# Altium project Odrive_M.PrjPcb (part 1 of 2)
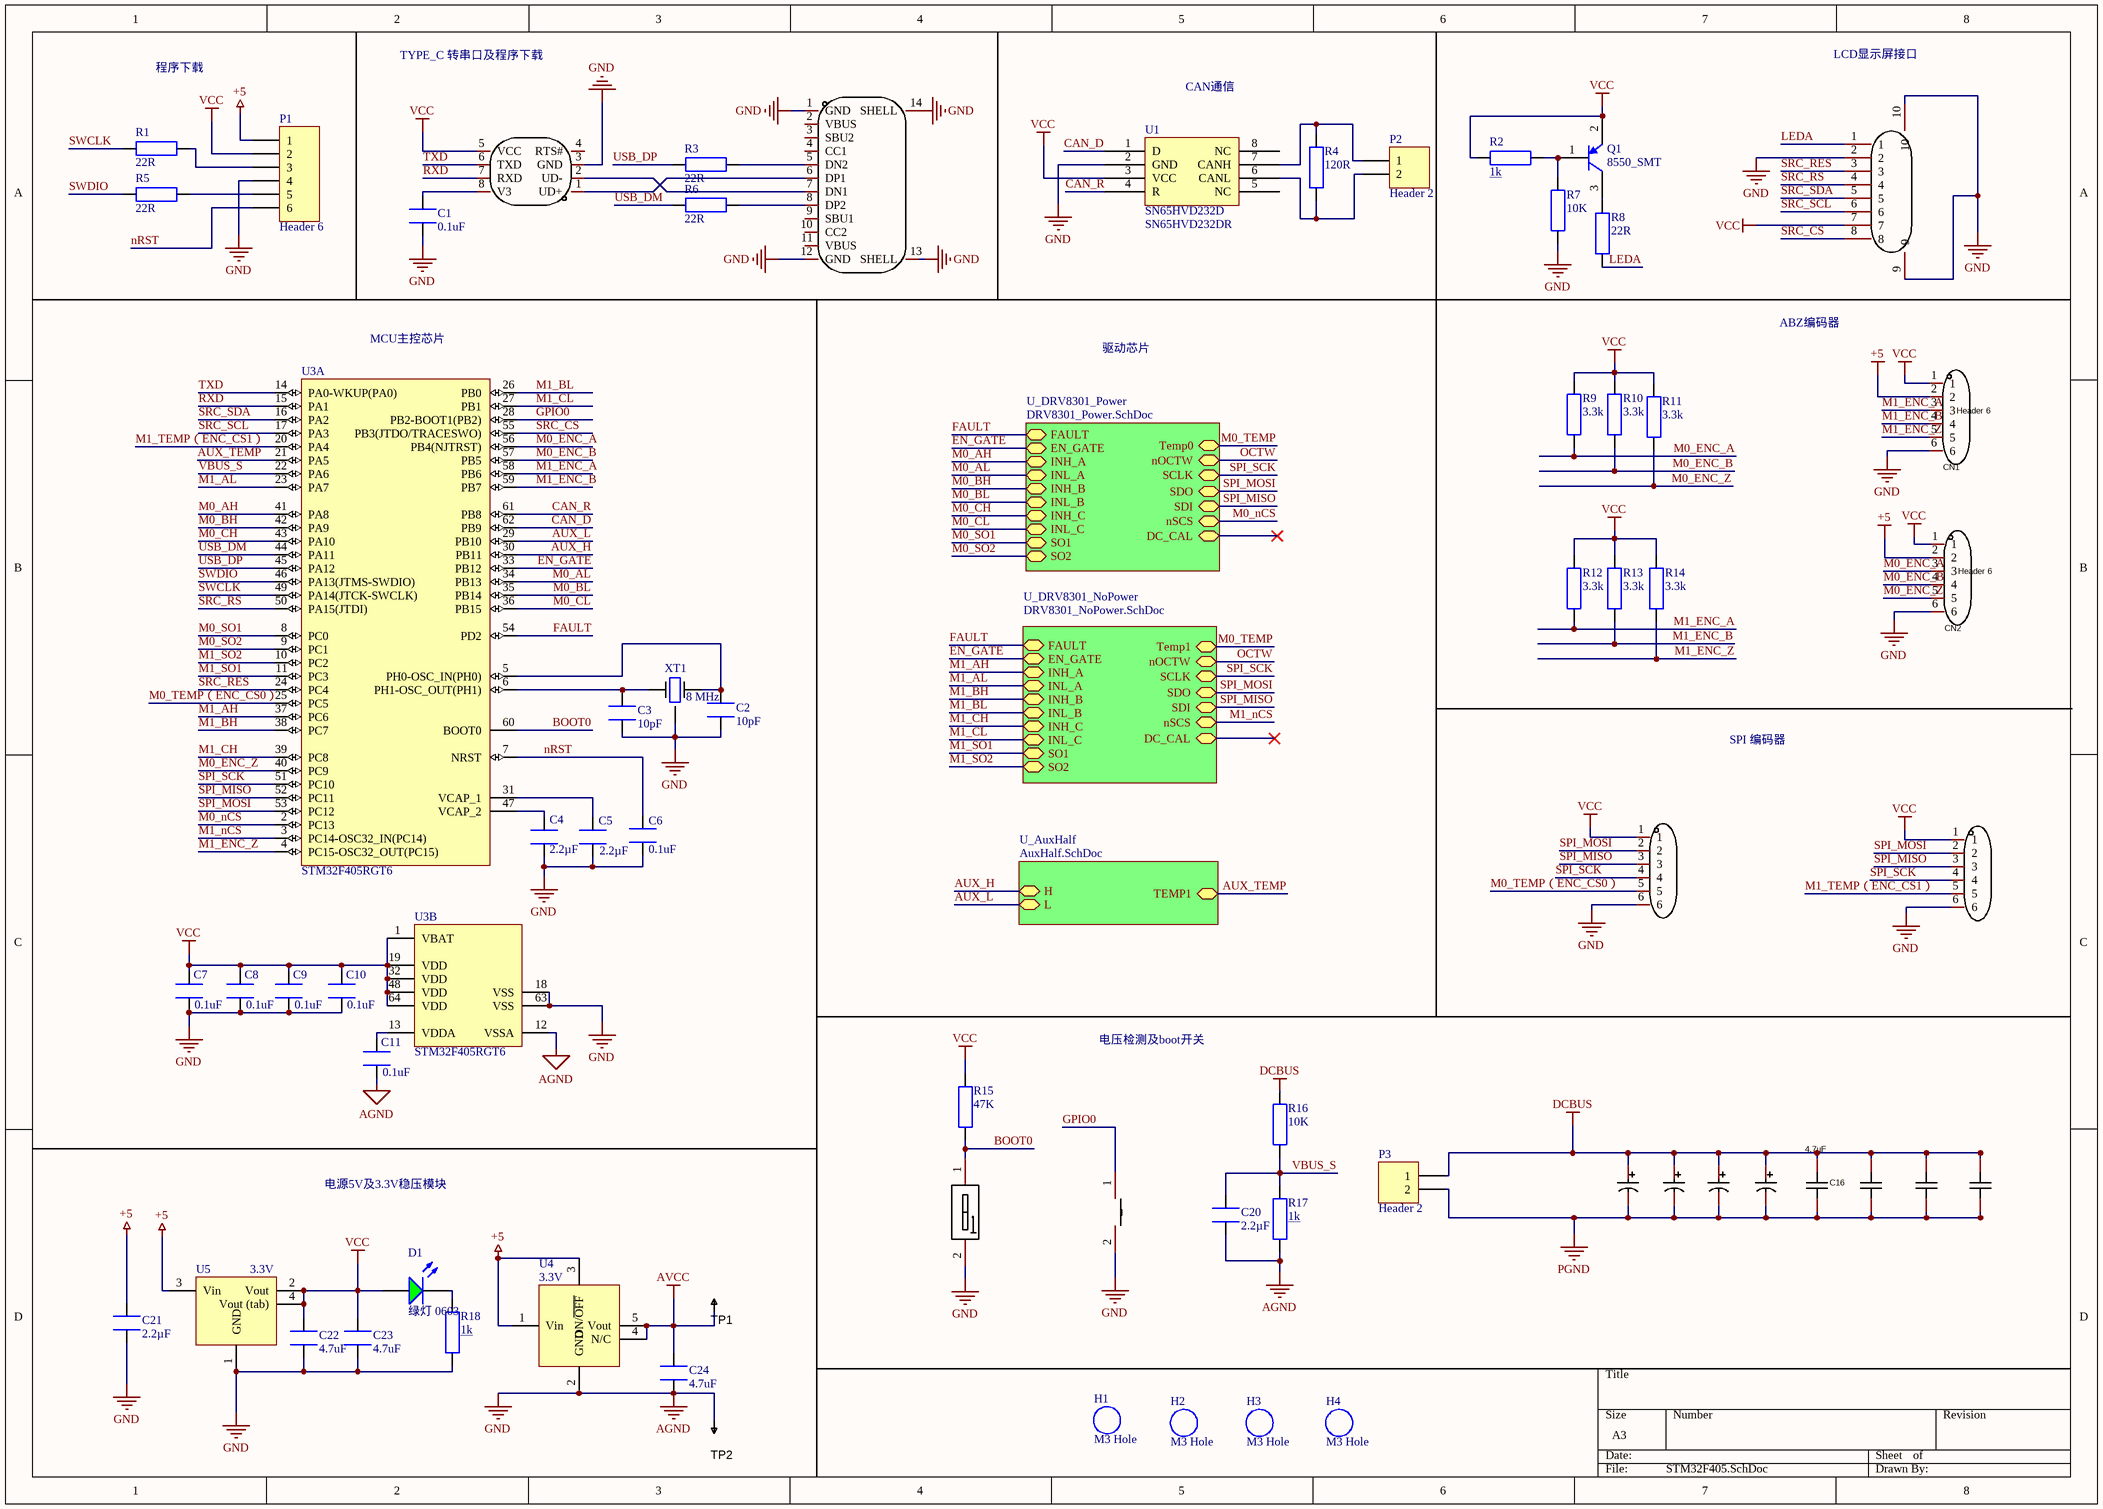
[diagram p0: STM32F405.SchDoc]
4 sheets, 190 parts. Net scope: hierarchical (ports join the sheet entries above them; power ports are global).
Board files: back_STM32F405.PcbDoc, back4_STM32F405.PcbDoc, STM32F405.PcbDoc
Sheets:
  STM32F405.SchDoc
    U_AuxHalf = AuxHalf.SchDoc
    U_DRV8301_Power = DRV8301_Power.SchDoc
    U_DRV8301_NoPower = DRV8301_NoPower.SchDoc

## Sheet STM32F405.SchDoc
size A3; SheetNumber: 1; SheetTotal: 4

### Parts
C1  0.1uF  [CAPC1608X09L]
C2  10pF  [CAPC1608X09L]
C3  10pF  [CAPC1608X09L]
C4  2.2µF  [CAPC1608X09L]
C5  2.2µF  [CAPC1608X09L]
C6  0.1uF  [CAPC1608X09L]
C7  0.1uF  [CAPC1608X09L]
C8  0.1uF  [CAPC1608X09L]
C9  0.1uF  [CAPC1608X09L]
C10  0.1uF  [CAPC1608X09L]
C11  0.1uF  [CAPC1608X09L]
C12  220uF  [CAP-SMD_BD12.5-L13.0-W13.0-FD]  (value not drawn)
C13  220uF  [CAP-SMD_BD12.5-L13.0-W13.0-FD]  (value not drawn)
C14  220uF  [CAP-SMD_BD12.5-L13.0-W13.0-FD]  (value not drawn)
C15  220uF  [CAP-SMD_BD12.5-L13.0-W13.0-FD]  (value not drawn)
C16  4.7uF  [C1210]
C17  4.7uF  [C1210]  (value not drawn)
C18  4.7uF  [C1210]  (value not drawn)
C19  4.7uF  [C1210]  (value not drawn)
C20  2.2µF  [CAPC1608X09L]
C21  2.2µF  [CAPC1608X09L]
C22  value 4.7uF  [CAPC2012X09N]  (hidden comment: GRM21BR61H475KE51L)
C23  value 4.7uF  [CAPC2012X09N]  (hidden comment: GRM21BR61H475KE51L)
C24  value 4.7uF  [CAPC2012X09N]  (hidden comment: GRM21BR61H475KE51L)
CN1  Header 6  [XH254-6]
CN2  Header 6  [XH254-6]
CN3  X8821WR-06S-N0SN  [CONN-TH_6P-P2.50_X8821WR-06S-N2SN]  (value not drawn)
CN4  X8821WR-06S-N0SN  [CONN-TH_6P-P2.50_X8821WR-06S-N2SN]  (value not drawn)
D1  绿灯 0603  [0603_LED_S1]
FPC1  AFC01-S08FCA-00  [FPC-SMD_P0.50-8P_FGS-XJ-H2.0]  (value not drawn)
H1  M3 Hole  [M3 Hole]
H2  M3 Hole  [M3 Hole]
H3  M3 Hole  [M3 Hole]
H4  M3 Hole  [M3 Hole]
P1  Header 6  [SIP-6]
P2  Header 2  [XH254-2]
P3  Header 2  [CONN-TH_XT30U-M]
Q1  8550_SMT  [SOT-23(SOT-23-3)]
R1  22R  [RESC1608X55N]
R2  1k  [RESC1608X55N]
R3  22R  [RESC1608X55N]
R4  120R  [RESC1608X55N]
R5  22R  [RESC1608X55N]
R6  22R  [RESC1608X55N]
R7  10K  [RESC1608X55N]
R8  22R  [RESC1608X55N]
R9  3.3k  [RESC1608X55N]
R10  3.3k  [RESC1608X55N]
R11  3.3k  [RESC1608X55N]
R12  3.3k  [RESC1608X55N]
R13  3.3k  [RESC1608X55N]
R14  3.3k  [RESC1608X55N]
R15  47K  [RESC1608X55N]
R16  10K  [RESC1608X55N]
R17  1k  [RESC1608X55N]
R18  1k  [RESC1608X55N]
SW1  DSWB01LHGET  [SW-TH_DSWB01LHGET]  (value not drawn)
SW2  TS-1101-C-W  [SW-SMD_L6.0-W3.3-LS8.0]  (value not drawn)
TP1  TESTPOINT  [TP-R30]  (value not drawn)  (no BOM)
TP2  TESTPOINT  [TP-R30]  (value not drawn)  (no BOM)
U1  SN65HVD232D  Manufacturer Part Number: SN65HVD232DR  [SOIC127P600X175-8N]
U2  CH340N  [ch340N  SOP-8_L4.9-W3.9-P1.27-LS6.0-BL]  (value not drawn)
U3  STM32F405RGT6  [STM-LQFP64_N]  (parts A,B of 2)
U4  3.3V  [SOT23-5]
U5  3.3V  [SOT223]
USB1  TYPE-C 16PIN 2MD(073)  [USB-C-SMD_TYPE-C-16PIN-2MD-073]  (value not drawn)
XT1  8 MHz  [DFN220P320X110-4N]

### Sub-sheets
U_AuxHalf = AuxHalf.SchDoc: TEMP1 (bidir), H (bidir), L (bidir)
U_DRV8301_NoPower = DRV8301_NoPower.SchDoc: Temp1 (bidir), FAULT (bidir), EN_GATE (bidir), INH_A (bidir), INL_A (bidir), INH_B (bidir), INL_B (bidir), INH_C (bidir), INL_C (bidir), SO1 (bidir), SO2 (bidir), nOCTW (bidir), SCLK (bidir), SDO (bidir), SDI (bidir), nSCS (bidir), DC_CAL (bidir)
U_DRV8301_Power = DRV8301_Power.SchDoc: FAULT (bidir), EN_GATE (bidir), INH_A (bidir), INL_A (bidir), INH_B (bidir), INL_B (bidir), INH_C (bidir), INL_C (bidir), SO1 (bidir), SO2 (bidir), Temp0 (bidir), nOCTW (bidir), SCLK (bidir), SDO (bidir), SDI (bidir), nSCS (bidir), DC_CAL (bidir)

### Nets
+5: C21.2 CN1.2 CN2.2 P1.1 U4.1(Vin) U4.3(ON/~{OFF}) U5.3(Vin)
AGND: C1.1 C2.2 C3.2 C4.1 C5.1 C6.1 C7.1 C8.1 C9.1 C10.1 C11.1 C20.1 C21.1 C22.1 C23.1 C24.1 CN1.6 CN2.6 CN3.6 CN4.6 FPC1.2 FPC1.9 FPC1.10 P1.4 R7.1 R17.1 R18.1 SW1.2 SW2.2 TP2.1 U1.2(GND) U2.3(GND) U3.12(VSSA) U3.18(VSS) U3.63(VSS) U4.2(GND) U5.1(GND) USB1.1(GND) USB1.12(GND) USB1.13(SHELL) USB1.14(SHELL) XT1.G  [also labelled GND]
AVCC: C24.2 TP1.1 U4.4(N/C) U4.5(Vout)
DCBUS: C12.1 C13.1 C14.1 C15.1 C16.1 C17.2 C18.2 C19.2 P3.1 R16.2
PGND: C12.2 C13.2 C14.2 C15.2 C16.2 C17.1 C18.1 C19.1 P3.2
VCC: C7.2 C8.2 C9.2 C10.2 C22.2 C23.2 CN1.1 CN2.1 CN3.1 CN4.1 D1.A FPC1.7 P1.2 Q1.2(E) R2.2 R9.2 R10.2 R11.2 R12.2 R13.2 R14.2 R15.2 U1.3(VCC) U2.5(VCC) U3.1(VBAT) U3.19(VDD) U3.32(VDD) U3.48(VDD) U3.64(VDD) U5.2(Vout) U5.4(Vout_(tab))
AUX_H: U3.30(PB11) ; sheet U_AuxHalf/H
AUX_L: U3.29(PB10) ; sheet U_AuxHalf/L
AUX_TEMP: U3.21(PA5) ; sheet U_AuxHalf/TEMP1
BOOT0: R15.1 SW1.1(A1) U3.60(BOOT0)  [project net BOOT0_1]
CAN_D: U1.1(D) U3.62(PB9)  [project net CAN_D_1]
CAN_R: U1.4(R) U3.61(PB8)  [project net CAN_R_1]
EN_GATE: U3.33(PB12) ; sheet U_DRV8301_Power/EN_GATE, sheet U_DRV8301_NoPower/EN_GATE
FAULT: U3.54(PD2) ; sheet U_DRV8301_Power/FAULT, sheet U_DRV8301_NoPower/FAULT
GPIO0: SW2.1 U3.28(PB2-BOOT1(PB2))  [project net GPIO0_1]
LEDA: FPC1.1 R8.1  [project net LEDA_1]
M0_AH: U3.41(PA8) ; sheet U_DRV8301_Power/INH_A
M0_AL: U3.34(PB13) ; sheet U_DRV8301_Power/INL_A
M0_BH: U3.42(PA9) ; sheet U_DRV8301_Power/INH_B
M0_BL: U3.35(PB14) ; sheet U_DRV8301_Power/INL_B
M0_CH: U3.43(PA10) ; sheet U_DRV8301_Power/INH_C
M0_CL: U3.36(PB15) ; sheet U_DRV8301_Power/INL_C
M0_ENC_A: CN2.3 R9.1 U3.56(PB4(NJTRST))  [project net M0_ENC_A_1]
M0_ENC_B: CN2.4 R10.1 U3.57(PB5)  [project net M0_ENC_B_1]
M0_ENC_Z: CN2.5 R11.1 U3.40(PC9)  [project net M0_ENC_Z_1]
M0_nCS: U3.2(PC13) ; sheet U_DRV8301_Power/nSCS
M0_SO1: U3.8(PC0) ; sheet U_DRV8301_Power/SO1
M0_SO2: U3.9(PC1) ; sheet U_DRV8301_Power/SO2
M0_TEMP: sheet U_DRV8301_Power/Temp0, sheet U_DRV8301_NoPower/Temp1
M0_TEMP（ENC_CS0）: CN3.5 U3.25(PC5)  [project net M0_TEMP（ENC_CS0）_1]
M1_AH: U3.37(PC6) ; sheet U_DRV8301_NoPower/INH_A
M1_AL: U3.23(PA7) ; sheet U_DRV8301_NoPower/INL_A
M1_BH: U3.38(PC7) ; sheet U_DRV8301_NoPower/INH_B
M1_BL: U3.26(PB0) ; sheet U_DRV8301_NoPower/INL_B
M1_CH: U3.39(PC8) ; sheet U_DRV8301_NoPower/INH_C
M1_CL: U3.27(PB1) ; sheet U_DRV8301_NoPower/INL_C
M1_ENC_A: CN1.3 R12.1 U3.58(PB6)  [project net M1_ENC_A_1]
M1_ENC_B: CN1.4 R13.1 U3.59(PB7)  [project net M1_ENC_B_1]
M1_ENC_Z: CN1.5 R14.1 U3.4(PC15-OSC32_OUT(PC15))  [project net M1_ENC_Z_1]
M1_nCS: U3.3(PC14-OSC32_IN(PC14)) ; sheet U_DRV8301_NoPower/nSCS
M1_SO1: U3.11(PC3) ; sheet U_DRV8301_NoPower/SO1
M1_SO2: U3.10(PC2) ; sheet U_DRV8301_NoPower/SO2
M1_TEMP（ENC_CS1）: CN4.5 U3.20(PA4)  [project net M1_TEMP（ENC_CS1）_1]
nRST: C6.2 P1.6 U3.7(NRST)  [project net nRST_1]
OCTW: sheet U_DRV8301_Power/nOCTW, sheet U_DRV8301_NoPower/nOCTW
RXD: U2.7(RXD) U3.15(PA1)  [project net RXD_1]
SPI_MISO: CN3.3 CN4.3 U3.52(PC11) ; sheet U_DRV8301_Power/SDI, sheet U_DRV8301_NoPower/SDI
SPI_MOSI: CN3.2 CN4.2 U3.53(PC12) ; sheet U_DRV8301_Power/SDO, sheet U_DRV8301_NoPower/SDO
SPI_SCK: CN3.4 CN4.4 U3.51(PC10) ; sheet U_DRV8301_Power/SCLK, sheet U_DRV8301_NoPower/SCLK
SRC_CS: FPC1.8 U3.55(PB3(JTDO/TRACESWO))  [project net SRC_CS_1]
SRC_RES: FPC1.3 U3.24(PC4)  [project net SRC_RES_1]
SRC_RS: FPC1.4 U3.50(PA15(JTDI))  [project net SRC_RS_1]
SRC_SCL: FPC1.6 U3.17(PA3)  [project net SRC_SCL_1]
SRC_SDA: FPC1.5 U3.16(PA2)  [project net SRC_SDA_1]
SWCLK: R1.2 U3.49(PA14(JTCK-SWCLK))  [project net SWCLK_1]
SWDIO: R5.2 U3.46(PA13(JTMS-SWDIO))  [project net SWDIO_1]
TXD: U2.6(TXD) U3.14(PA0-WKUP(PA0))  [project net TXD_1]
USB_DM: R6.2 U3.44(PA11)  [project net USB_DM_1]
USB_DP: R3.2 U3.45(PA12)  [project net USB_DP_1]
VBUS_S: C20.2 R16.1 R17.2 U3.22(PA6)  [project net VBUS_S_1]
NetC1_2: C1.2 U2.8(V3)
NetC2_1: C2.1 U3.5(PH0-OSC_IN(PH0)) XT1.3
NetC3_1: C3.1 U3.6(PH1-OSC_OUT(PH1)) XT1.1
NetC4_2: C4.2 U3.47(VCAP_2)
NetC5_2: C5.2 U3.31(VCAP_1)
NetC11_2: C11.2 U3.13(VDDA)
NetD1_K: D1.K R18.2
NetP1_3: P1.3 R1.1
NetP1_5: P1.5 R5.1
NetP2_1: P2.1 R4.2 U1.7(CANH)
NetP2_2: P2.2 R4.1 U1.6(CANL)
NetQ1_1: Q1.1(B) R2.1 R7.2
NetQ1_3: Q1.3(C) R8.2
NetR3_1: R3.1 USB1.5(DN2)
NetR6_1: R6.1 USB1.8(DP2)
NetU2_1: U2.1(UD+) USB1.6(DP1)
NetU2_2: U2.2(UD-) USB1.7(DN1)

Not connected (* = marked no-connect by the designer): U1 5(NC) 8(NC); U2 4(RTS#); USB1 2(VBUS) 3(SBU2) 4(CC1) 9(SBU1) 10(CC2) 11(VBUS)

### Notes on the sheet
- 程序下载
- TYPE_C 转串口及程序下载
- CAN通信
- LCD显示屏接口
- (near U3) MCU主控芯片
- 驱动芯片
- ABZ编码器
- SPI 编码器
- 电压检测及boot开关
- 电源5V及3.3V稳压模块

### Library data of the parts
C1 C6-C11 = GRM188R71H104KA93D: CAP CER 0.1UF 50V X7R 0603; Manufacturer: Murata Electronics North America; Tolerance: ±10%; Supplier 1: Digi-Key; Supplier Part Number 1: 490-1519-2-ND; Manufacturer Part Number: GRM188R71H104KA93D; RoHS: RoHS Compliant; Category: Capacitors; Pricing 1: 4000=0.01822, 8000=0.01663, 12000=0.01584 (USD); Packaging: Tape & Reel (TR); Capacitance: 0.1uF; Voltage - Rated: 50V; Temperature Coefficient: X7R; Mounting Type: Surface Mount, MLCC; Operating Temperature: -55°C ~ 125°C; Applications: General Purpose; Ratings: -; Package / Case: 0603 (1608 Metric); Size / Dimension: 0.063" L x 0.032" W (1.60mm x 0.80mm); Height - Seated (Max): -; Thickness (Max): 0.035" (0.90mm); Lead Spacing: -; Features: -; Lead Style: -; ComponentLink1URL: http://www.murata.com/~/media/webrenewal/support/library/catalog/products/capacitor/mlcc/c02e.ashx?la=en-us; ComponentLink1Description: http://www.murata.com/~/media/webrenewal/support/library/catalog/products/capacitor/mlcc/c02e.ashx?la=en-us; Stock: 19812000; Part Status: Active; Supplier 2: Digi-Key; Supplier Part Number 2: 490-1519-1-ND; Pricing 2: 1=0.12, 10=0.084, 100=0.0396, 500=0.02778, 1000=0.023 (USD)
C2 C3 = GRM1885C1H100JA01D: CAP CER 10PF 50V NP0 0603; Manufacturer: Murata Electronics North America; Tolerance: ±5%; Temperature Coefficient: C0G, NP0; Supplier 1: Digi-Key; Supplier Part Number 1: 490-1403-1-ND; Manufacturer Part Number: GRM1885C1H100JA01D; RoHS: RoHS Compliant; Category: Capacitors; Stock 1: 450321; Pricing 1: 1=0.1, 10=0.041, 50=0.0222, 100=0.0187, 250=0.01532, 500=0.0131, 1000=0.0102 (USD); Packaging: Cut Tape (CT); Capacitance: 10pF; Voltage - Rated: 50V; Mounting Type: Surface Mount, MLCC; Operating Temperature: -55°C ~ 125°C; Applications: General Purpose; Ratings: -; Package / Case: 0603 (1608 Metric); Size / Dimension: 0.063" L x 0.031" W (1.60mm x 0.80mm); Height - Seated (Max): -; Thickness (Max): 0.035" (0.90mm); Lead Spacing: -; Features: -; Lead Style: -; ComponentLink1URL: http://www.murata.com/~/media/webrenewal/support/library/catalog/products/capacitor/mlcc/c02e.pdf; ComponentLink1Description: http://www.murata.com/~/media/webrenewal/support/library/catalog/products/capacitor/mlcc/c02e.pdf
C4 C5 C20 C21 = GRM188R61C225KE15D: CAP CER 2.2UF 16V X5R 0603; Manufacturer: Murata Electronics North America; Tolerance: ±10%; Supplier 1: Digi-Key; Supplier Part Number 1: 490-3296-1-ND; Manufacturer Part Number: GRM188R61C225KE15D; RoHS: RoHS Compliant; Category: Capacitors; Stock 1: 1255740; Pricing 1: 1=0.12, 10=0.08, 50=0.046, 100=0.038, 250=0.032, 500=0.0268, 1000=0.022 (USD); Packaging: Cut Tape (CT); Capacitance: 2.2µF; Voltage - Rated: 16V; Temperature Coefficient: X5R; Mounting Type: Surface Mount, MLCC; Operating Temperature: -55°C ~ 85°C; Applications: General Purpose; Ratings: -; Package / Case: 0603 (1608 Metric); Size / Dimension: 0.063" L x 0.031" W (1.60mm x 0.80mm); Height - Seated (Max): -; Thickness (Max): 0.035" (0.90mm); Lead Spacing: -; Features: -; Lead Style: -; ComponentLink1URL: http://www.murata.com/~/media/webrenewal/support/library/catalog/products/capacitor/mlcc/c02e.pdf; ComponentLink1Description: http://www.murata.com/~/media/webrenewal/support/library/catalog/products/capacitor/mlcc/c02e.pdf
C12-C15 = VZH221M1JTR-1313: 63v 220uF 贴片电容; Manufacturer: lelon(立隆); Symbol: VZH221M1J1313-TRO; Add into BOM: yes; Tolerance: ±20%; φD: 12.5mm; L: 13.5mm; Lifetime @ Temp: 5000hrs@105℃; Name: 220uF; Device: VZH221M1JTR-1313; LCSC Part Name: 220uF ±20% 63V; Supplier Part: C249882; Manufacturer Part: VZH221M1JTR-1313; Supplier Footprint: SMD,D12.5xL13.5mm; JLCPCB Part Class: Extended Part; Datasheet: https://atta.szlcsc.com/upload/public/pdf/source/20190107/C358632_9559F0E8F2A4CAD9C84FAF7E6C56D904.pdf; Supplier: LCSC; Convert to PCB: yes; Value: 220uF; Rated Voltage: 63V; Ripple Current: -; Equivalent Series Resistance(ESR): -; Operating Temperature: -45℃~+105℃
C16-C19 = C1210X7R475K630NT: 4.7uF 63V 1210封装; Manufacturer: SANYEAR(叁叶源); Add into BOM: yes; Temperature Coefficient: X7R; Name: 4.7uF; Symbol: C1210X7R475K630NT; Device: C1210X7R475K630NT; LCSC Part Name: 4.7uF 63V; Supplier Part: C2911397; Manufacturer Part: C1210X7R475K630NT; Supplier Footprint: 1210; JLCPCB Part Class: Extended Part; Datasheet: https://atta.szlcsc.com/upload/public/pdf/source/20210902/8F39E0658D363F48630A7672568BDC14.pdf; Supplier: LCSC; Convert to PCB: yes; Value: 4.7uF; Voltage Rated: 63V
C22-C24 = GRM21BR61H475KE51L: CAP CER 4.7UF 50V X5R 0805; Manufacturer: Murata Electronics North America; Tolerance: ±10%; Supplier 1: Digi-Key; Supplier Part Number 1: 490-10751-2-ND; RoHS: RoHS Compliant; Category: Capacitors; Stock: 15000; Pricing 1: 3000=0.08404, 6000=0.07774, 9000=0.07354 (USD); Packaging: Tape & Reel (TR); Part Status: Active; Voltage - Rated: 50V; Temperature Coefficient: X5R; Operating Temperature: -55°C ~ 85°C; Features: -; Ratings: -; Applications: General Purpose; Mounting Type: Surface Mount, MLCC; Package / Case: 0805 (2012 Metric); Size / Dimension: 0.079" L x 0.049" W (2.00mm x 1.25mm); Height - Seated (Max): -; Thickness (Max): 0.055" (1.40mm); Lead Spacing: -; Lead Style: -; ComponentLink1URL: http://search.murata.co.jp/Ceramy/image/img/A01X/G101/ENG/GRM21BR61H475KE51-01.pdf; ComponentLink1Description: http://search.murata.co.jp/Ceramy/image/img/A01X/G101/ENG/GRM21BR61H475KE51-01.pdf; Supplier 2: Digi-Key; Supplier Part Number 2: 490-10751-1-ND; Pricing 2: 1=0.35, 10=0.242, 100=0.145, 500=0.10872, 1000=0.09181 (USD); Manufacturer Part Number: GRM21BR61H475KE51L
CN1-CN4 = X8821WR-06S-N0SN: 6p 90度弯插; Manufacturer: XKB Connection(中国星坤); Add into BOM: yes; Pins Structure: 1x6P; Pitch: 2.5mm; Reference Series: XH; Number of PINs Per Row: 6; Current Rating (Max): 3A; Name: X8821WR-06S-N0SN; Symbol: X8821WR-06S-N0SN; Device: X8821WR-06S-N0SN; LCSC Part Name: 1x6P 间距:2.5mm 弯插 系列:XH; Supplier Part: C388743; Manufacturer Part: X8821WR-06S-N0SN; Supplier Footprint: 弯插,P=2.54mm; JLCPCB Part Class: Extended Part; Datasheet: https://atta.szlcsc.com/upload/public/pdf/source/20211009/984C14C41D2B1156BCF8EEF5D296E395.pdf; Supplier: LCSC; Convert to PCB: yes; Mounting Style: 弯插; Number of Pins: 6P; Number of Rows: 1; Row Spacing: -; Contact Material: 黄铜; Contact Plating: 锡; Operating Temperature Range: -
D1 = 0603 绿灯: 发光二极管; ComponentLink1Description: 供应商链接; ComponentLink1URL: http://www.szlcsc.com/product/details_73152.html; Package: 0603; Supplier: LC; SuppliersPartNumber: C72043
FPC1 = AFC01-S08FCA-00: 显示屏 8P FPC接口; Manufacturer: JS(钜硕电子); Add into BOM: yes; Locking Feature: 翻盖式; Pitch: 0.5mm; FFC, FCB Thickness: 0.3mm; Name: AFC01-S08FCA-00; Symbol: AFC01-S08FCA-00; Device: AFC01-S08FCA-00; LCSC Part Name: 间距:0.5mm P数:8P 翻盖式 下接; Supplier Part: C262657; Manufacturer Part: AFC01-S08FCA-00; Supplier Footprint: SMD,P=0.5mm,卧贴; JLCPCB Part Class: Extended Part; Datasheet: https://atta.szlcsc.com/upload/public/pdf/source/20190816/C413942_2A72D1AC756EAE17EEDF756A339D4500.pdf; Supplier: LCSC; Convert to PCB: yes; Contact Type: 下接; Number of Contacts: 8P; Mounting Type: 卧贴; Height Above Board: 2mm
H1-H4 = M3 Hole: M3 Hole with no copper
P1 = Header 6: Header, 6-Pin; LatestRevisionDate: 17-Jul-2002; LatestRevisionNote: Re-released for DXP Platform.; Publisher: Altium Limited
P2 P3 = Header 2: Header, 2-Pin; LatestRevisionDate: 17-Jul-2002; LatestRevisionNote: Re-released for DXP Platform.; Publisher: Altium Limited
Q1 = 8550_SOT-23: PNP型小功率三极管; HelpURL: http://pdf1.alldatasheetcn.com/datasheet-pdf/view/33679/WINGS/9014.html
R1 R3 R5 R6 R8 = RC0603FR-0722RL: RES SMD 22 OHM 1% 1/10W 0603; Manufacturer: Yageo; Resistance (Ohms): 22; Power (Watts): 0.1W, 1/10W; Temperature Coefficient: ±100ppm/°C; Supplier 1: Digi-Key; Supplier Part Number 1: 311-22.0HRCT-ND; Manufacturer Part Number: RC0603FR-0722RL; RoHS: RoHS Compliant; Category: Resistors; Stock 1: 575303; Pricing 1: 1=0.1, 10=0.014, 25=0.01, 100=0.0057, 250=0.00436, 500=0.00348, 1000=0.00257, 2500=0.00223 (USD); Packaging: Cut Tape (CT); Tolerance: ±1%; Composition: Thick Film; Features: Moisture Resistant; Operating Temperature: -55°C ~ 155°C; Package / Case: 0603 (1608 Metric); Supplier Device Package: 0603; Size / Dimension: 0.063" L x 0.031" W (1.60mm x 0.80mm); Height: 0.022" (0.55mm); Number of Terminations: 2; ComponentLink1URL: http://www.yageo.com/documents/recent/PYu-RC_Group_51_RoHS_L_04.pdf; ComponentLink1Description: http://www.yageo.com/documents/recent/PYu-RC_Group_51_RoHS_L_04.pdf
R2 R17 R18 = RC0603FR-071KL: RES SMD 1K OHM 1% 1/10W 0603; Manufacturer: Yageo; Power (Watts): 0.1W, 1/10W; Temperature Coefficient: ±100ppm/°C; Supplier 1: Digi-Key; Supplier Part Number 1: 311-1.00KHRCT-ND; RoHS: RoHS Compliant; Category: Resistors; Stock 1: 6734836; Pricing 1: 1=0.1, 10=0.014, 25=0.01, 100=0.0057, 250=0.00436, 500=0.00348, 1000=0.00257, 2500=0.00223 (USD); Packaging: Cut Tape (CT); Tolerance: ±1%; Composition: Thick Film; Features: Moisture Resistant; Operating Temperature: -55°C ~ 155°C; Package / Case: 0603 (1608 Metric); Supplier Device Package: 0603; Size / Dimension: 0.063" L x 0.031" W (1.60mm x 0.80mm); Height: 0.022" (0.55mm); Number of Terminations: 2; ComponentLink1URL: http://www.yageo.com/documents/recent/PYu-RC_Group_51_RoHS_L_04.pdf; ComponentLink1Description: http://www.yageo.com/documents/recent/PYu-RC_Group_51_RoHS_L_04.pdf; Manufacturer Part Number: RC0603FR-071KL; Resistance (Ohms): 1k
R4 = RC0603FR-07120RL: RES SMD 120 OHM 1% 1/10W 0603; Manufacturer: Yageo; Resistance (Ohms): 120; Power (Watts): 0.1W, 1/10W; Temperature Coefficient: ±100ppm/°C; Supplier 1: Digi-Key; Supplier Part Number 1: 311-120HRCT-ND; Manufacturer Part Number: RC0603FR-07120RL; RoHS: RoHS Compliant; Category: Resistors; Stock 1: 1545282; Pricing 1: 1=0.1, 10=0.014, 25=0.01, 100=0.0057, 250=0.00436, 500=0.00348, 1000=0.00257, 2500=0.00223 (USD); Packaging: Cut Tape (CT); Tolerance: ±1%; Composition: Thick Film; Features: Moisture Resistant; Operating Temperature: -55°C ~ 155°C; Package / Case: 0603 (1608 Metric); Supplier Device Package: 0603; Size / Dimension: 0.063" L x 0.031" W (1.60mm x 0.80mm); Height: 0.022" (0.55mm); Number of Terminations: 2; ComponentLink1URL: http://www.yageo.com/documents/recent/PYu-RC_Group_51_RoHS_L_04.pdf; ComponentLink1Description: http://www.yageo.com/documents/recent/PYu-RC_Group_51_RoHS_L_04.pdf
R7 R16 = RC0603FR-0710KL: RES SMD 10K OHM 1% 1/10W 0603; Manufacturer: Yageo; Power (Watts): 0.1W, 1/10W; Temperature Coefficient: ±100ppm/°C; Supplier 1: Digi-Key; Supplier Part Number 1: 311-10.0KHRCT-ND; Manufacturer Part Number: RC0603FR-0710KL; RoHS: RoHS Compliant; Category: Resistors; Stock 1: 13504930; Pricing 1: 1=0.1, 10=0.014, 25=0.01, 100=0.0057, 250=0.00436, 500=0.00348, 1000=0.00257, 2500=0.00223 (USD); Packaging: Cut Tape (CT); Resistance (Ohms): 10k; Tolerance: ±1%; Composition: Thick Film; Features: Moisture Resistant; Operating Temperature: -55°C ~ 155°C; Package / Case: 0603 (1608 Metric); Supplier Device Package: 0603; Size / Dimension: 0.063" L x 0.031" W (1.60mm x 0.80mm); Height: 0.022" (0.55mm); Number of Terminations: 2; ComponentLink1URL: http://www.yageo.com/documents/recent/PYu-RC_Group_51_RoHS_L_04.pdf; ComponentLink1Description: http://www.yageo.com/documents/recent/PYu-RC_Group_51_RoHS_L_04.pdf
R9-R14 = RC0603FR-073K3L: RES SMD 3.3K OHM 1% 1/10W 0603; Manufacturer: Yageo; Power (Watts): 0.1W, 1/10W; Temperature Coefficient: ±100ppm/°C; Supplier 1: Digi-Key; Supplier Part Number 1: 311-3.30KHRCT-ND; Manufacturer Part Number: RC0603FR-073K3L; RoHS: RoHS Compliant; Category: Resistors; Stock 1: 420019; Pricing 1: 1=0.1, 10=0.014, 25=0.01, 100=0.0057, 250=0.00436, 500=0.00348, 1000=0.00257, 2500=0.00223 (USD); Packaging: Cut Tape (CT); Resistance (Ohms): 3.3k; Tolerance: ±1%; Composition: Thick Film; Features: Moisture Resistant; Operating Temperature: -55°C ~ 155°C; Package / Case: 0603 (1608 Metric); Supplier Device Package: 0603; Size / Dimension: 0.063" L x 0.031" W (1.60mm x 0.80mm); Height: 0.022" (0.55mm); Number of Terminations: 2; ComponentLink1URL: http://www.yageo.com/documents/recent/PYu-RC_Group_51_RoHS_L_04.pdf; ComponentLink1Description: http://www.yageo.com/documents/recent/PYu-RC_Group_51_RoHS_L_04.pdf
R15 = RC0603FR-0747KL: RES SMD 47K OHM 1% 1/10W 0603; Manufacturer: Yageo; Power (Watts): 0.1W, 1/10W; Temperature Coefficient: ±100ppm/°C; Supplier 1: Digi-Key; Supplier Part Number 1: 311-47.0KHRCT-ND; Manufacturer Part Number: RC0603FR-0747KL; RoHS: RoHS Compliant; Category: Resistors; Stock 1: 930868; Pricing 1: 1=0.1, 10=0.014, 25=0.01, 100=0.0057, 250=0.00436, 500=0.00348, 1000=0.00257, 2500=0.00223 (USD); Packaging: Cut Tape (CT); Resistance (Ohms): 47k; Tolerance: ±1%; Composition: Thick Film; Features: Moisture Resistant; Operating Temperature: -55°C ~ 155°C; Package / Case: 0603 (1608 Metric); Supplier Device Package: 0603; Size / Dimension: 0.063" L x 0.031" W (1.60mm x 0.80mm); Height: 0.022" (0.55mm); Number of Terminations: 2; ComponentLink1URL: http://www.yageo.com/documents/recent/PYu-RC_Group_51_RoHS_L_04.pdf; ComponentLink1Description: http://www.yageo.com/documents/recent/PYu-RC_Group_51_RoHS_L_04.pdf
SW1 = DSWB01LHGET: 单刀拨码开关; Manufacturer: YE; Add into BOM: yes; Circuit: 单刀单掷; Number of Positions: 1位; Name: DSWB01LHGET; Symbol: DSWB01LHGET; Device: DSWB01LHGET; LCSC Part Name: 红色宽体1位顶拨插件; Supplier Part: C126888; Manufacturer Part: DSWB01LHGET; Supplier Footprint: 插件,9.9x4mm; JLCPCB Part Class: Extended Part; Datasheet: https://atta.szlcsc.com/upload/public/pdf/source/20240423/2AB41BE17D24959C6789B2A71E54D492.pdf; Supplier: LCSC; Convert to PCB: yes; Type: 平拨,凸起式; Lead Pitch: -; Operating Life: -; Color: 红色
SW2 = TS-1101-C-W: 轻触开关; Manufacturer: XKB Connectivity(中国星坤); Add into BOM: yes; Circuit: 单刀单掷; Actuator Style: 矩形按钮; Operating Force: 260gf; Switch Length: 6mm; Switch Width: 3.6mm; Switch Height: 2.5mm; Strike Gundam: 不带; Contact Current: 50mA; Voltage Rating (DC): 12V; Actuator/Cap Color: 白色带淡绿; With Lamp: 无; Mechanical Life: 5万次; Name: TS-1101-C-W; Symbol: TS-1101-C-W; Device: TS-1101-C-W; LCSC Part Name: 6*3.6*2.5mm 立贴 轻触开关; Supplier Part: C318938; Manufacturer Part: TS-1101-C-W; Supplier Footprint: SMD; JLCPCB Part Class: Extended Part; Datasheet: https://atta.szlcsc.com/upload/public/pdf/source/20200227/C318938_C2E53B1EEDE37D980A33616AC086DE53.pdf; Supplier: LCSC; Convert to PCB: yes; Mounting Style: 立贴; Voltage Rating (AC): -; Power Rating: -; Insulation Resistance: -; IP Rating: -; Pin Style: -; Operating Temperature: -30℃~+85℃
TP1 TP2 = TESTPOINT: SMD test pin
U1 = SN65HVD232D: Manufacturer: Texas Instruments; Protocol: CAN; Number of Drivers/Receivers: 1/1; Duplex: Half; Data Rate: 1Mbps; Voltage - Supply: 3 V ~ 3.6 V; Supplier 1: Digi-Key; Supplier Part Number 1: 296-26344-2-ND; RoHS: RoHS Compliant; Category: Integrated Circuits (ICs); Stock: 5000; Pricing 1: 2500=0.84375 (USD); Packaging: Tape & Reel (TR); Part Status: Active; Type: Transceiver; Operating Temperature: -40°C ~ 85°C; Mounting Type: Surface Mount; Package / Case: 8-SOIC (0.154", 3.90mm Width); Supplier Device Package: 8-SOIC; ComponentLink1URL: http://www.ti.com/lit/ds/symlink/sn65hvd230.pdf; ComponentLink1Description: http://www.ti.com/lit/ds/symlink/sn65hvd230.pdf; Supplier 2: Digi-Key; Supplier Part Number 2: 296-26344-1-ND; Pricing 2: 1=2.05, 10=1.842, 100=1.4809, 500=1.21668, 1000=1.00811 (USD)
U2 = CH340N: Manufacturer: WCH(南京沁恒); Symbol: CH340N_C2977777; Add into BOM: yes; Name: CH340N; Device: CH340N; LCSC Part Name: USB转串口芯片 CH340; Supplier Part: C2977777; Manufacturer Part: CH340N; Supplier Footprint: SOP-8; JLCPCB Part Class: Extended Part; Datasheet: https://atta.szlcsc.com/upload/public/pdf/source/20230530/6E401E9554E9F5311886CC8B3F89B62E.pdf; Supplier: LCSC; Convert to PCB: yes
U3 = STM32F405RGT6: ARM Cortex-M4 32-bit MCU+FPU, 210 DMIPS, 1024 kB Flash, 192 kB Internal RAM, 51 I/Os, 64-pin LQFP, -40 to 85 degC, Tray; Manufacturer: STMicroelectronics; D/A Converter: 2x12-bit; FLASH Size (Prog) (kB): 1024; I/Os (High Current): 51; Internal RAM Size (kB): 192; Operating Frequency(F) (Processor speed) (MHz): 168; Supply Voltage(Vcc) max (V): 3.6; Supply Voltage(Vcc) min (V): 1.8; DatasheetVersion: Rev. 4; PackageVersion: Rev. 4, 06/2013; PackageReference: LQFP64; PackageDescription: 64-Pin Low Profile Quad Flat Package, 10 x 10 mm Body, 0.5 mm Pitch; Supplier 1: Digi-Key; Supplier Part Number 1: 497-11767-ND; Supplier 2: Farnell; Supplier Part Number 2: 2064363; Supplier 3: Newark; Supplier Part Number 3: 73T2329; Supplier 4: Mouser; Supplier Part Number 4: 511-STM32F405RGT6; Core: ARM Cortex-M4; Packing: Tray; Mounting Technology: Surface Mount; PartNumber: STM32F405RGT6; ComponentLink1Description: Manufacturer URL; ComponentLink1URL: http://www.st.com/web/en/home.html; ComponentLink2Description: Datasheet; ComponentLink2URL: http://www.st.com/st-web-ui/static/active/en/resource/technical/document/datasheet/DM00037051.pdf; ComponentLink3Description: Package Specification; ComponentLink3URL: http://www.st.com/st-web-ui/static/active/en/resource/technical/document/datasheet/DM00037051.pdf
U4 = LP5907MFX-3.3/NOPB: IC REG LDO 3.3V 0.25A SOT23-5; Manufacturer: Texas Instruments; Regulator Topology: Positive Fixed; Current - Output: 250mA; Voltage - Input: Up to 5.5V; Supplier 1: Digi-Key; Supplier Part Number 1: 296-38557-1-ND; RoHS: RoHS Compliant; Category: Integrated Circuits (ICs); Stock 1: 39845; Pricing 1: 1=0.57, 10=0.487, 100=0.3634, 500=0.28552, 1000=0.22063 (USD); Packaging: Cut Tape (CT); Part Status: Active; Voltage - Output: 3.3V; Voltage - Dropout (Typical): -; Current - Limit (Min): -; Operating Temperature: -40°C ~ 125°C; Mounting Type: Surface Mount; Package / Case: SC-74A, SOT-753; Supplier Device Package: SOT-23; ComponentLink1URL: http://www.ti.com/lit/ds/symlink/lp5907.pdf; ComponentLink1Description: http://www.ti.com/lit/ds/symlink/lp5907.pdf
U5 = AZ1117EH-3.3TRG1: IC REG LDO 3.3V 1A SOT223; Manufacturer: Diodes Incorporated; Regulator Topology: Positive Fixed; Voltage - Dropout (Typical): 1.1V @ 1A; Voltage - Input: Up to 13V; Supplier 1: Digi-Key; Supplier Part Number 1: AZ1117EH-3.3TRG1DICT-ND; RoHS: RoHS Compliant; Category: Integrated Circuits (ICs); Stock 1: 22748; Pricing 1: 1=0.43, 10=0.321, 100=0.1815, 500=0.12022, 1000=0.09216 (USD); Packaging: Cut Tape (CT); Part Status: Active; Voltage - Output: 3.3V; Current - Output: 1A; Current - Limit (Min): -; Operating Temperature: -40°C ~ 125°C; Mounting Type: Surface Mount; Package / Case: TO-261-4, TO-261AA; Supplier Device Package: SOT-223; ComponentLink1URL: http://www.diodes.com/assets/Datasheets/AZ1117E.pdf; ComponentLink1Description: http://www.diodes.com/assets/Datasheets/AZ1117E.pdf
USB1 = TYPE-C 16PIN 2MD(073): Manufacturer: SHOU HAN(首韩); Add into BOM: yes; Gender: 母; Number of Ports: 1; Number of Contacts: 16P; Current Rating - Power (Max): 5A; Name: TYPE-C 16PIN 2MD(073); Symbol: TYPE-C 16PIN 2MD(073); Device: TYPE-C 16PIN 2MD(073); LCSC Part Name: Type-C 母 卧贴; Supplier Part: C2765186; Manufacturer Part: TYPE-C 16PIN 2MD(073); Supplier Footprint: SMD; JLCPCB Part Class: Extended Part; Datasheet: https://atta.szlcsc.com/upload/public/pdf/source/20211123/39B17C16241EAC15C5E277BDA434118E.pdf; Supplier: LCSC; Convert to PCB: yes; Connector Type: Type-C; Standard: -; Mounting Style: 卧贴; Operating Temperature Range: -25℃~+85℃
XT1 = ABM3B-8.000MHZ-10-1-U-T: Crystal 8MHz ±10ppm 10pF 200 Ohm -10°C ~ 60°C Surface Mount 4-SMD, No Lead (DFN, LCC); Manufacturer: Abracon LLC; Operating Mode: Fundamental; Supplier 1: Digi-Key; Supplier Part Number 1: 535-9721-1-ND; RoHS: RoHS Compliant; Category: Crystals, Oscillators, Resonators; Stock: 35437; Pricing 1: 1=0.69, 10=0.578, 50=0.5198, 100=0.462, 500=0.4389 (USD); Packaging: Cut Tape (CT); Part Status: Active; Type: MHz Crystal; Frequency Stability: ±10ppm; Frequency Tolerance: ±10ppm; Load Capacitance: 10pF; Operating Temperature: -10°C ~ 60°C; Ratings: -; Mounting Type: Surface Mount; Package / Case: 4-SMD, No Lead; Size / Dimension: 0.197" L x 0.126" W (5.00mm x 3.20mm); Height - Seated (Max): 0.043" (1.10mm); ComponentLink1URL: http://www.abracon.com/Resonators/abm3b.pdf; ComponentLink1Description: http://www.abracon.com/Resonators/abm3b.pdf; Supplier 2: Digi-Key; Supplier Part Number 2: 535-9721-2-ND; Pricing 2: 1000=0.336, 3000=0.315, 5000=0.3045, 10000=0.294 (USD); Manufacturer Part Number: ABM3B-8.000MHZ-10-1-U-T; Value: 8 MHz

## Sheet AuxHalf.SchDoc
size A4; SheetNumber: 4; SheetTotal: 4
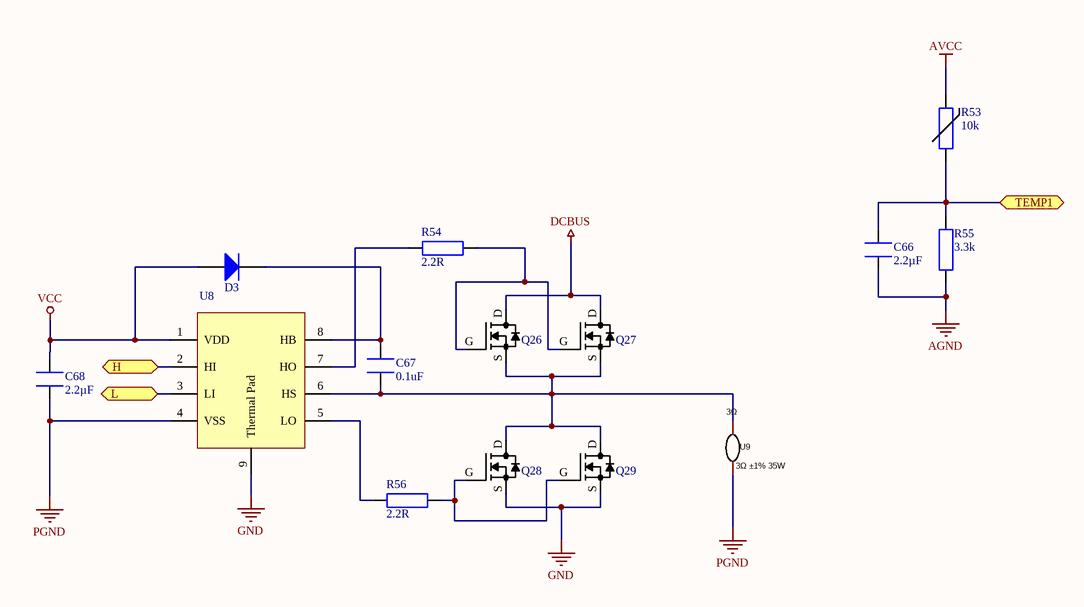
[diagram p1: AuxHalf.SchDoc]

### Parts
C66  2.2µF  [CAPC1608X09L]
C67  0.1uF  [CAPC1608X09L]
C68  2.2µF  [CAPC1608X09L]
D3  MBR140SFT1G  [DIOM2717X10N]  (value not drawn)
Q26  NTMFS5C628NLT  [SO8FL]  (value not drawn)
Q27  NTMFS5C628NLT  [SO8FL]  (value not drawn)
Q28  NTMFS5C628NLT  [SO8FL]  (value not drawn)
Q29  NTMFS5C628NLT  [SO8FL]  (value not drawn)
R53  value 10k  [RESC1005X40N]  (hidden comment: NCP15XH103F03RC)
R54  2.2R  [RESC1608X55N]
R55  3.3k  [RESC1608X55N]
R56  2.2R  [RESC1608X55N]
U8  LM5109BSD/NOPB  [SON80P400X80_HS-9N]  (value not drawn)
U9  3Ω  LCSC Part Name: 3Ω ±1% 35W  [TO-220-2L_L10.2-W4.6-P5.08-L]

### Ports
H (bidir), L (bidir), TEMP1 (bidir)

### Nets
AGND: C66.1 Q28.S Q29.S R55.1 U8.9(Thermal_Pad)  [also labelled GND]
AVCC: R53.2
DCBUS: Q26.D Q27.D
PGND: C68.1 U8.4(VSS) U9.1
VCC: C68.2 D3.A U8.1(VDD)
AUX_H: U8.2(HI) ; port H
AUX_L: U8.3(LI) ; port L
AUX_TEMP: C66.2 R53.1 R55.2 ; port TEMP1
NetC67_1: C67.1 Q26.S Q27.S Q28.D Q29.D U8.6(HS) U9.2
NetC67_2: C67.2 D3.K U8.8(HB)
NetQ26_G: Q26.G Q27.G R54.1
NetQ28_G: Q28.G Q29.G R56.1
NetR54_2: R54.2 U8.7(HO)
NetR56_2: R56.2 U8.5(LO)

### Library data of the parts
C66 C68 = GRM188R61C225KE15D: as C4 on sheet STM32F405; Supplier 1: Digi-Key; Supplier Part Number 1: 490-3296-1-ND; Manufacturer Part Number: GRM188R61C225KE15D; RoHS: RoHS Compliant; Category: Capacitors; Stock 1: 1255740; Pricing 1: 1=0.12, 10=0.08, 50=0.046, 100=0.038, 250=0.032, 500=0.0268, 1000=0.022 (USD); Packaging: Cut Tape (CT); Capacitance: 2.2µF; Voltage - Rated: 16V; Temperature Coefficient: X5R; Mounting Type: Surface Mount, MLCC; Operating Temperature: -55°C ~ 85°C; Applications: General Purpose; Ratings: -; Package / Case: 0603 (1608 Metric); Size / Dimension: 0.063" L x 0.031" W (1.60mm x 0.80mm); Height - Seated (Max): -; Thickness (Max): 0.035" (0.90mm); Lead Spacing: -; Features: -; Lead Style: -; ComponentLink1URL: http://www.murata.com/~/media/webrenewal/support/library/catalog/products/capacitor/mlcc/c02e.pdf; ComponentLink1Description: http://www.murata.com/~/media/webrenewal/support/library/catalog/products/capacitor/mlcc/c02e.pdf
C67 = GRM188R71H104KA93D: as C1 on sheet STM32F405; Supplier 1: Digi-Key; Supplier Part Number 1: 490-1519-2-ND; Manufacturer Part Number: GRM188R71H104KA93D; RoHS: RoHS Compliant; Category: Capacitors; Pricing 1: 4000=0.01822, 8000=0.01663, 12000=0.01584 (USD); Packaging: Tape & Reel (TR); Capacitance: 0.1uF; Voltage - Rated: 50V; Temperature Coefficient: X7R; Mounting Type: Surface Mount, MLCC; Operating Temperature: -55°C ~ 125°C; Applications: General Purpose; Ratings: -; Package / Case: 0603 (1608 Metric); Size / Dimension: 0.063" L x 0.032" W (1.60mm x 0.80mm); Height - Seated (Max): -; Thickness (Max): 0.035" (0.90mm); Lead Spacing: -; Features: -; Lead Style: -; ComponentLink1URL: http://www.murata.com/~/media/webrenewal/support/library/catalog/products/capacitor/mlcc/c02e.ashx?la=en-us; ComponentLink1Description: http://www.murata.com/~/media/webrenewal/support/library/catalog/products/capacitor/mlcc/c02e.ashx?la=en-us; Stock: 19812000; Part Status: Active; Supplier 2: Digi-Key; Supplier Part Number 2: 490-1519-1-ND; Pricing 2: 1=0.12, 10=0.084, 100=0.0396, 500=0.02778, 1000=0.023 (USD)
D3 = MBR140SFT1G: Rectifier Diode, Single, 40 V, 1 A, SOD-123FL, 2, 550 mV
Q26-Q29 = NTMFS5C628NLT: MOSFET N-CH 60V SO8FL; Manufacturer: ON Semiconductor; Manufacturer Part Number: NTMFS5C628NLT1G; FET Type: N-Channel; Drive Voltage (Max Rds On,  Min Rds On): 4.5V, 10V; Vgs(th) (Max) @ Id: 2V @ 135µA; Gate Charge (Qg) (Max) @ Vgs: 52nC @ 10V; Input Capacitance (Ciss) (Max) @ Vds: 3600pF @ 25V; Vgs (Max): ±20V; Power Dissipation (Max): 3.7W (Ta), 110W (Tc); Rds On (Max) @ Id, Vgs: 2.4 mOhm @ 50A, 10V; Supplier 1: Digi-Key; Supplier Part Number 1: NTMFS5C628NLT1GOSCT-ND; RoHS: RoHS Compliant; Category: Discrete Semiconductor Products; Stock: 1490; Pricing 1: 1=1.8, 10=1.627, 100=1.3078, 500=1.01716 (USD); Packaging: Cut Tape (CT); Part Status: Active; Technology: MOSFET (Metal Oxide); Current - Continuous Drain (Id) @ 25°C: -; FET Feature: -; Operating Temperature: -55°C ~ 175°C (TJ); Mounting Type: Surface Mount; Supplier Device Package: 5-DFN (5x6) (8-SOFL); Package / Case: 8-PowerTDFN; ComponentLink1URL: http://www.onsemi.com/pub/Collateral/NTMFS5C628NL-D.PDF; ComponentLink1Description: http://www.onsemi.com/pub/Collateral/NTMFS5C628NL-D.PDF; Supplier 2: Digi-Key; Supplier Part Number 2: NTMFS5C628NLT1GOSTR-ND; Pricing 2: 1500=0.81823 (USD)
R53 = NCP15XH103F03RC: THERMISTOR 10K OHM NTC 0402 SMD
R54 R56 = RC0603FR-072R2L: RES SMD 2.2 OHM 1% 1/10W 0603; Manufacturer: Yageo; Resistance (Ohms): 2.2; Power (Watts): 0.1W, 1/10W; Temperature Coefficient: ±200ppm/°C; Supplier 1: Digi-Key; Supplier Part Number 1: 311-2.2HRCT-ND; Manufacturer Part Number: RC0603FR-072R2L; RoHS: RoHS Compliant; Category: Resistors; Stock 1: 16531; Pricing 1: 1=0.1, 10=0.02, 25=0.0144, 100=0.0082, 250=0.00624, 500=0.00498, 1000=0.00367, 2500=0.00319 (USD); Packaging: Cut Tape (CT); Tolerance: ±1%; Composition: Thick Film; Features: Moisture Resistant; Operating Temperature: -55°C ~ 155°C; Package / Case: 0603 (1608 Metric); Supplier Device Package: 0603; Size / Dimension: 0.063" L x 0.031" W (1.60mm x 0.80mm); Height: 0.022" (0.55mm); Number of Terminations: 2; ComponentLink1URL: http://www.yageo.com/documents/recent/PYu-RC_Group_51_RoHS_L_04.pdf; ComponentLink1Description: http://www.yageo.com/documents/recent/PYu-RC_Group_51_RoHS_L_04.pdf
R55 = RC0603FR-073K3L: as R9 on sheet STM32F405; Supplier 1: Digi-Key; Supplier Part Number 1: 311-3.30KHRCT-ND; Manufacturer Part Number: RC0603FR-073K3L; RoHS: RoHS Compliant; Category: Resistors; Stock 1: 420019; Pricing 1: 1=0.1, 10=0.014, 25=0.01, 100=0.0057, 250=0.00436, 500=0.00348, 1000=0.00257, 2500=0.00223 (USD); Packaging: Cut Tape (CT); Resistance (Ohms): 3.3k; Tolerance: ±1%; Composition: Thick Film; Features: Moisture Resistant; Operating Temperature: -55°C ~ 155°C; Package / Case: 0603 (1608 Metric); Supplier Device Package: 0603; Size / Dimension: 0.063" L x 0.031" W (1.60mm x 0.80mm); Height: 0.022" (0.55mm); Number of Terminations: 2; ComponentLink1URL: http://www.yageo.com/documents/recent/PYu-RC_Group_51_RoHS_L_04.pdf; ComponentLink1Description: http://www.yageo.com/documents/recent/PYu-RC_Group_51_RoHS_L_04.pdf
U8 = LM5109BSD/NOPB: DRIVER, MOSFET, HALF BRIDGE, WSON-8, 1A; Supplier 1: Farnell; Supplier Part Number 1: 2400642RL; Supplier 2: Farnell; Supplier Part Number 2: 2400642; Supplier 3: Farnell; Supplier Part Number 3: 2382850
U9 = To-220-35W-3R-1%: 220封装2插电阻; Manufacturer: Milliohm(毫欧); Add into BOM: yes; Tolerance: ±1%; Overload Voltage (Max): 350V; Power(Watts): 35W; Name: 3Ω; Symbol: TO-220-35W-3R-1%; Device: To-220-35W-3R-1%; Supplier Part: C5209756; Manufacturer Part: To-220-35W-3R-1%; Supplier Footprint: TO-220-2; JLCPCB Part Class: Extended Part; Datasheet: https://atta.szlcsc.com/upload/public/pdf/source/20221020/51BE5AE648F6C576EF2EAAB1AEBF3830.pdf; Supplier: LCSC; Convert to PCB: yes; Value: 3Ω; Operating Temperature Range: -55℃~+150℃